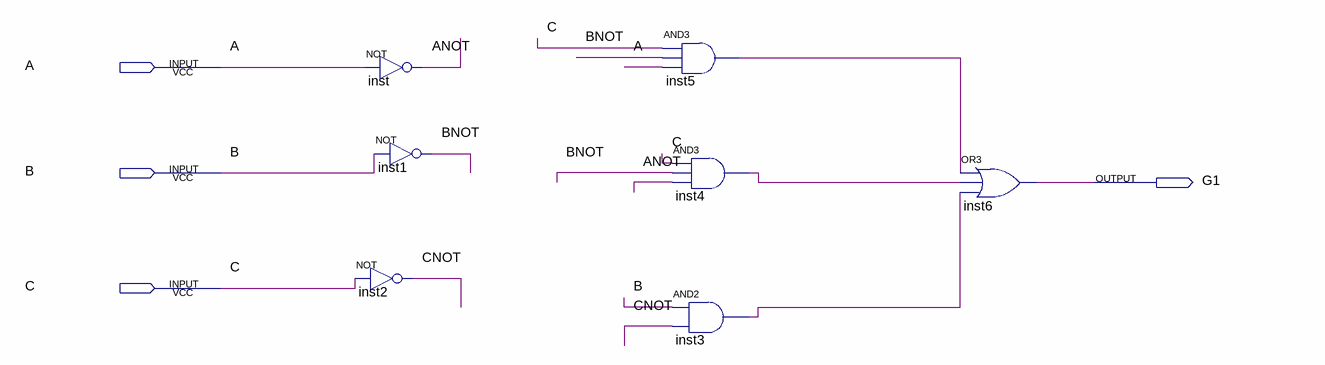
[diagram p0: schematic sheet]
// Quartus schematic Lab03G1.bdf as structural Verilog: 7 symbols, 4 pins
module Lab03G1 (
  input  A,
  input  B,
  input  C,
  output G1
);

  wire ANOT, BNOT, CNOT, inst3_out, inst4_out, inst5_out;

  not inst (ANOT, A);
  not inst1 (BNOT, B);
  not inst2 (CNOT, C);
  and inst5 (inst5_out, C, BNOT, A);
  and inst4 (inst4_out, C, BNOT, ANOT);
  and inst3 (inst3_out, B, CNOT);
  or inst6 (G1, inst5_out, inst4_out, inst3_out);
endmodule
